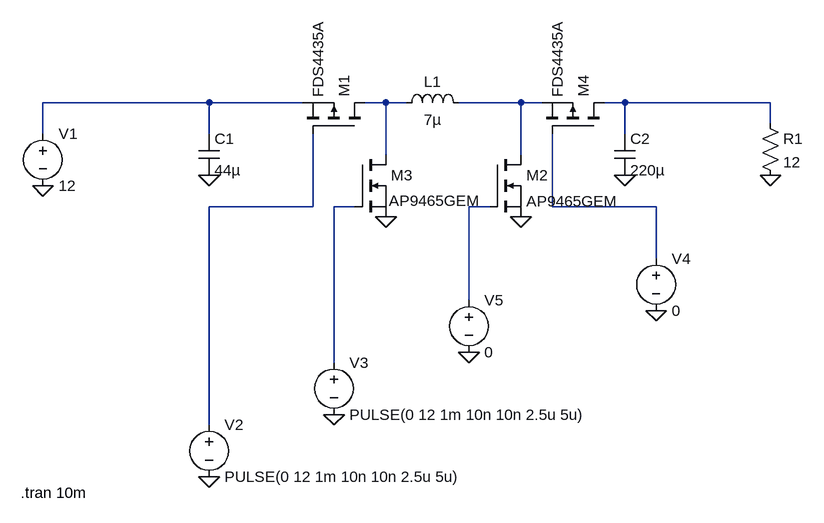
[diagram p0: schematic BuckBoost.asc]
BuckBoost.asc, the LTspice schematic file:
Version 4
SHEET 1 880 712
WIRE -144 96 -400 96
WIRE 0 96 -144 96
WIRE 128 96 96 96
WIRE 160 96 128 96
WIRE 336 96 240 96
WIRE 368 96 336 96
WIRE 496 96 464 96
WIRE 720 96 496 96
WIRE 720 128 720 96
WIRE -400 144 -400 96
WIRE -144 144 -144 96
WIRE 496 144 496 96
WIRE 128 176 128 96
WIRE 336 176 336 96
WIRE 16 256 16 144
WIRE 16 256 -144 256
WIRE 80 256 48 256
WIRE 288 256 256 256
WIRE 384 256 384 144
WIRE 544 256 384 256
WIRE 544 336 544 256
WIRE 256 400 256 256
WIRE 48 496 48 256
WIRE -144 592 -144 256
FLAG -400 224 0
FLAG -144 208 0
FLAG 128 272 0
FLAG 336 272 0
FLAG 496 208 0
FLAG 720 208 0
FLAG -144 672 0
FLAG 48 576 0
FLAG 544 416 0
FLAG 256 480 0
SYMBOL ind 144 112 R270
WINDOW 0 32 56 VTop 2
WINDOW 3 5 56 VBottom 2
SYMATTR InstName L1
SYMATTR Value 7µ
SYMBOL cap -160 144 R0
SYMATTR InstName C1
SYMATTR Value 44µ
SYMBOL cap 480 144 R0
SYMATTR InstName C2
SYMATTR Value 220µ
SYMBOL pmos 96 144 M270
SYMATTR InstName M1
SYMATTR Value FDS4435A
SYMBOL nmos 288 176 R0
SYMATTR InstName M2
SYMATTR Value AP9465GEM
SYMBOL nmos 80 176 R0
WINDOW 3 53 71 Left 2
SYMATTR InstName M3
SYMATTR Value AP9465GEM
SYMBOL pmos 464 144 M270
SYMATTR InstName M4
SYMATTR Value FDS4435A
SYMBOL voltage -400 128 R0
SYMATTR InstName V1
SYMATTR Value 12
SYMBOL res 704 112 R0
SYMATTR InstName R1
SYMATTR Value 12
SYMBOL voltage -144 576 R0
WINDOW 123 0 0 Left 0
WINDOW 39 0 0 Left 0
SYMATTR InstName V2
SYMATTR Value PULSE(0 12 1m 10n 10n 2.5u 5u)
SYMBOL voltage 48 480 R0
WINDOW 123 0 0 Left 0
WINDOW 39 0 0 Left 0
SYMATTR InstName V3
SYMATTR Value PULSE(0 12 1m 10n 10n 2.5u 5u)
SYMBOL voltage 544 320 R0
SYMATTR InstName V4
SYMATTR Value 0
SYMBOL voltage 256 384 R0
SYMATTR InstName V5
SYMATTR Value 0
TEXT -434 696 Left 2 !.tran 10m

The netlist it stands for:
* BuckBoost.asc
L1 N002 N003 7µ
C1 N001 0 44µ
C2 N004 0 220µ
M1 N002 N005 N001 N001 FDS4435A
M2 N003 N007 0 0 AP9465GEM
M3 N002 N006 0 0 AP9465GEM
M4 N004 N008 N003 N003 FDS4435A
V1 N001 0 12
R1 N004 0 12
V2 N005 0 PULSE(0 12 1m 10n 10n 2.5u 5u)
V3 N006 0 PULSE(0 12 1m 10n 10n 2.5u 5u)
V4 N008 0 0
V5 N007 0 0
.model NMOS NMOS
.model PMOS PMOS
.lib standard.mos
.tran 10m
.backanno
.end